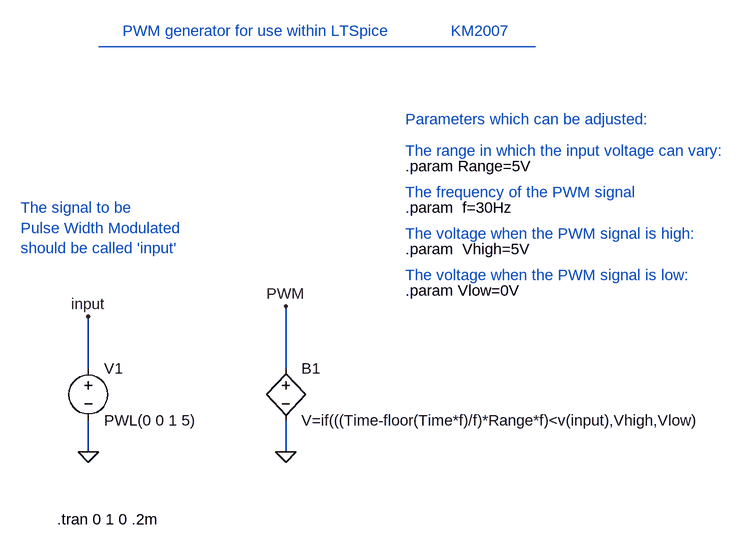
[diagram p0: schematic pwm.asc]
pwm.asc, the LTspice schematic file:
Version 4
SHEET 1 924 680
WIRE -192 192 -192 112
WIRE 112 192 112 96
WIRE -192 320 -192 272
WIRE 112 320 112 272
FLAG 112 320 0
FLAG -192 320 0
FLAG -192 112 input
FLAG 112 96 PWM
SYMBOL bv 112 176 R0
SYMATTR InstName B1
SYMATTR Value V=if(((Time-floor(Time*f)/f)*Range*f)<v(input),Vhigh,Vlow)
SYMBOL voltage -192 176 R0
WINDOW 123 0 0 Left 0
WINDOW 39 0 0 Left 0
SYMATTR InstName V1
SYMATTR Value PWL(0 0 1 5)
TEXT -240 424 Left 0 !.tran 0 1 0 .2m
TEXT 296 -120 Left 0 !.param Range=5V
TEXT 296 -56 Left 0 !.param  f=30Hz
TEXT 296 8 Left 0 !.param  Vhigh=5V
TEXT 296 -192 Left 0 ;Parameters which can be adjusted:
TEXT 296 -144 Left 0 ;The range in which the input voltage can vary:
TEXT 296 -80 Left 0 ;The frequency of the PWM signal
TEXT 296 72 Left 0 !.param Vlow=0V
TEXT 296 -16 Left 0 ;The voltage when the PWM signal is high:
TEXT 296 48 Left 0 ;The voltage when the PWM signal is low:
TEXT 160 -328 Center 0 ;PWM generator for use within LTSpice              KM2007
TEXT -296 -56 Left 0 ;The signal to be \nPulse Width Modulated \nshould be called 'input'
LINE Normal 496 -304 -176 -304

The netlist it stands for:
* pwm.asc
B1 PWM 0 V=if(((Time-floor(Time*f)/f)*Range*f)<v(input),Vhigh,Vlow)
V1 input 0 PWL(0 0 1 5)
.tran 0 1 0 .2m
.param Range=5V
.param  f=30Hz
.param  Vhigh=5V
* Parameters which can be adjusted:
* The range in which the input voltage can vary:
* The frequency of the PWM signal
.param Vlow=0V
* The voltage when the PWM signal is high:
* The voltage when the PWM signal is low:
* PWM generator for use within LTSpice              KM2007
* The signal to be
* Pulse Width Modulated
* should be called 'input'
.backanno
.end